# EAGLE design SoundModule (EAGLE 4.16)
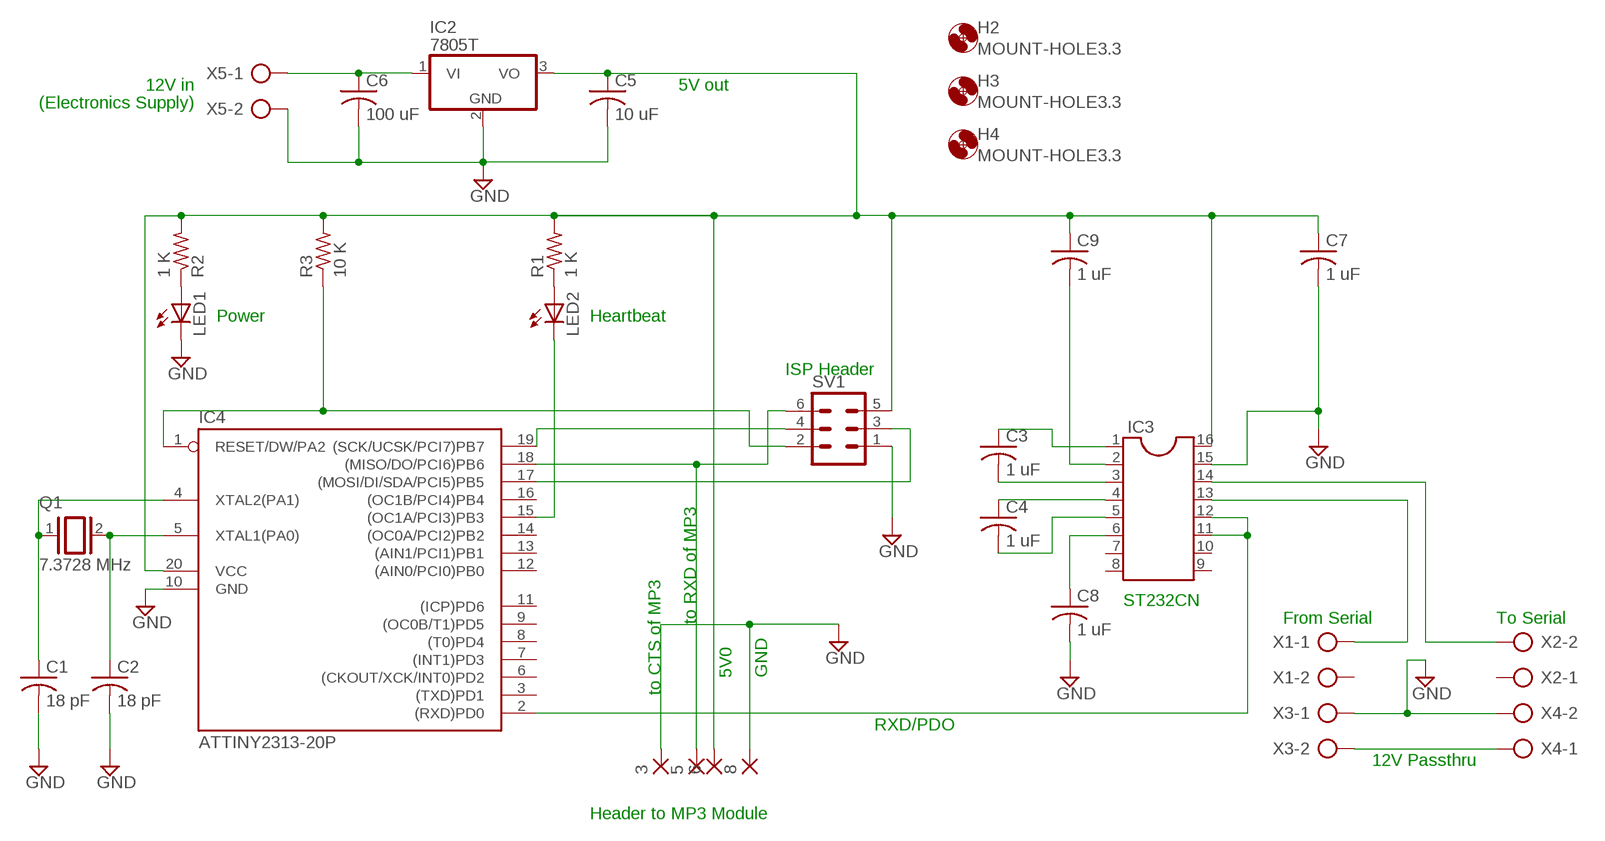
[diagram p0: schematic, sheet 1]

## Parts
3  1,6/0,8  [1,6/0,8]
5  1,6/0,8  [1,6/0,8]
6  1,6/0,8  [1,6/0,8]
8  1,6/0,8  [1,6/0,8]
C1  18 pF  C-US050-025X075  [C050-025X075]
C2  18 pF  C-US050-025X075  [C050-025X075]
C3  1 uF  C-US050-025X075  [C050-025X075]
C4  1 uF  C-US050-025X075  [C050-025X075]
C5  10 uF  C-US025-025X050  [C025-025X050]
C6  100 uF  C-US025-025X050  [C025-025X050]
C7  1 uF  C-US050-025X075  [C050-025X075]
C8  1 uF  C-US050-025X075  [C050-025X075]
C9  1 uF  C-US050-025X075  [C050-025X075]
H2  MOUNT-HOLE3.3  [3,3]
H3  MOUNT-HOLE3.3  [3,3]
H4  MOUNT-HOLE3.3  [3,3]
IC2  7805T  [TO220H]
IC3  DIL16  [DIL16]
IC4  ATTINY2313-20P  [DIL20]
LED1  LED5MM  [LED5MM]
LED2  LED5MM  [LED5MM]
Q1  7.3728 MHz  XTAL/S  [QS]
R1  1 K  R-US_0207/10  [0207/10]
R2  1 K  R-US_0207/10  [0207/10]
R3  10 K  R-US_0207/10  [0207/10]
SV1  MA03-2  [MA03-2]
X1  AK300/2  [AK300/2]
X2  AK300/2  [AK300/2]
X3  AK300/2  [AK300/2]
X4  AK300/2  [AK300/2]
X5  AK300/2  [AK300/2]

## Nets
GND: 3.1(P) 8.1(P) C1.2 C2.2 C5.2 C6.2 C7.2 C8.2 IC2.2(GND) IC3.15 IC4.10(GND) LED1.K(C) SV1.1 X3.1 X4.2 X5.2
N$1: C1.1 IC4.4(XTAL2(PA1)) Q1.1
N$2: C2.1 IC4.5(XTAL1(PA0)) Q1.2
N$3: C6.1 IC2.1(VI) X5.1
N$5: C3.1 IC3.1
N$6: 5.1(P) IC4.18((MISO/DO/PCI6)PB6) SV1.6
N$7: LED1.A R2.1
N$8: IC3.13 X1.1
N$9: IC3.14 X2.2
N$10: LED2.A R1.1
N$11: X3.2 X4.1
N$12: C3.2 IC3.3
N$13: C4.1 IC3.4
N$14: C4.2 IC3.5
N$15: C8.1 IC3.6
N$16: C9.2 IC3.2
N$18: IC4.19((SCK/UCSK/PCI7)PB7) SV1.4
N$19: IC4.17((MOSI/DI/SDA/PCI5)PB5) SV1.3
N$20: IC4.15((OC1A/PCI3)PB3) LED2.K(C)
N$22: IC4.1(RESET/DW/PA2) R3.1 SV1.2
N$23: IC3.11 IC3.12 IC4.2((RXD)PD0)
N$24: 6.1(P) C5.1 C7.1 C9.1 IC2.3(VO) IC3.16 IC4.20(VCC) R1.2 R2.2 R3.2 SV1.5
Unconnected: IC3.7 IC3.8 IC3.9 IC3.10 IC4.3((TXD)PD1) IC4.6((CKOUT/XCK/INT0)PD2) IC4.7((INT1)PD3) IC4.8((T0)PD4) IC4.9((OC0B/T1)PD5) IC4.11((ICP)PD6) IC4.12((AIN0/PCI0)PB0) IC4.13((AIN1/PCI1)PB1) IC4.14((OC0A/PCI2)PB2) IC4.16((OC1B/PCI4)PB4) X1.2 X2.1

## Notes on the sheet
- 12V in | 5V out
- (Electronics Supply)
- Power | Heartbeat
- ISP Header
- ST232CN
- to RXD of MP3 | From Serial | To Serial
- 5V0 | GND
- to CTS of MP3
- RXD/PDO
- 12V Passthru
- Header to MP3 Module

## Library data of the parts
3 5 6 8 = wirepad:1,6/0,8: THROUGH-HOLE PAD
C1-C9 = rcl:C-US: CAPACITOR, American symbol
H2-H4 = holes:MOUNT-HOLE: MOUNTING HOLE with drill center marker
IC2 = linear:78*: Positive VOLTAGE REGULATOR Source: http://cache.national.com/ds/LM/LM78L05.pdf http://www.fairchildsemi.com/ds/LM/LM7805.pdf
IC3 = ic-package:DIL16: Dual In Line
IC4 = avr:ATTINY2313: MICROCONTROLLER 2 Kbytes FLASH 128 bytes SRAM 128 bytes EEPROM USART USI
LED1 LED2 = led:LED: LED OSRAM: - CHIPLED LG R971, LG N971, LY N971, LG Q971, LY Q971, LO R971, LY R971 LH N974, LH R974 LS Q976, LO Q976, LY Q976 LO Q996 - Hyper CHIPLED LW Q18S LB Q993, LB Q99A, LB R99A - SideLED LS A670, LO A670, LY A670, LG A670, LP A670 LB A673, LV A673, LT A673, LW A673 LH A674 LY A675 LS A676, LA A676, LO A676, LY A676, LW A676 LS A679, LY A679, LG A679 - Hyper Micro SIDELED® LS Y876, LA Y876, LO Y876, LY Y876 LT Y87S - SmartLED LW L88C, LW L88S LB L89C, LB L89S, LG L890 LS L89K, LO L89K, LY L89K LS L896, LA L896, LO L896, LY L896 - TOPLED LS T670, LO T670, LY T670, LG T670, LP T670 LSG T670, LSP T670, LSY T670, LOP T670, LYG T670 LG T671, LOG T671, LSG T671 LB T673, LV T673, LT T673, LW T673 LH T674 LS T676, LA T676, LO T676, LY T676, LB T676, LH T676, LSB T676, LW T676 LB T67C, LV T67C, LT T67C, LS T67K, LO T67K, LY T67K, LW E67C LS E67B, LA E67B, LO E67B, LY E67B, LB E67C, LV E67C, LT E67C LW T67C LS T679, LY T679, LG T679 LS T770, LO T770, LY T770, LG T770, LP T770 LB T773, LV T773, LT T773, LW T773 LH T774 LS E675, LA E675, LY E675, LS T675 LS T776, LA T776, LO T776, LY T776, LB T776 LHGB T686 LT T68C, LB T68C - Hyper Mini TOPLED® LB M676 - Mini TOPLED Santana® LG M470 LS M47K, LO M47K, LY M47K Source: http://www.osram.convergy.de - LUMILED® LXK2-PW12-R00, LXK2-PW12-S00, LXK2-PW14-U00, LXK2-PW14-V00 LXK2-PM12-R00, LXK2-PM12-S00, LXK2-PM14-U00 LXK2-PE12-Q00, LXK2-PE12-R00, LXK2-PE12-S00, LXK2-PE14-T00, LXK2-PE14-U00 LXK2-PB12-K00, LXK2-PB12-L00, LXK2-PB12-M00, LXK2-PB14-N00, LXK2-PB14-P00, LXK2-PB14-Q00 LXK2-PR12-L00, LXK2-PR12-M00, LXK2-PR14-Q00, LXK2-PR14-R00 LXK2-PD12-Q00, LXK2-PD12-R00, LXK2-PD12-S00 LXK2-PH12-R00, LXK2-PH12-S00 LXK2-PL12-P00, LXK2-PL12-Q00, LXK2-PL12-R00 Source: www.luxeon.com
Q1 = special:XTAL/S: CRYSTAL
R1-R3 = rcl:R-US_: RESISTOR, American symbol
SV1 = con-lstb:MA03-2: PIN HEADER
X1-X5 = con-ptr500:AK300/2: CONNECTOR

## Board
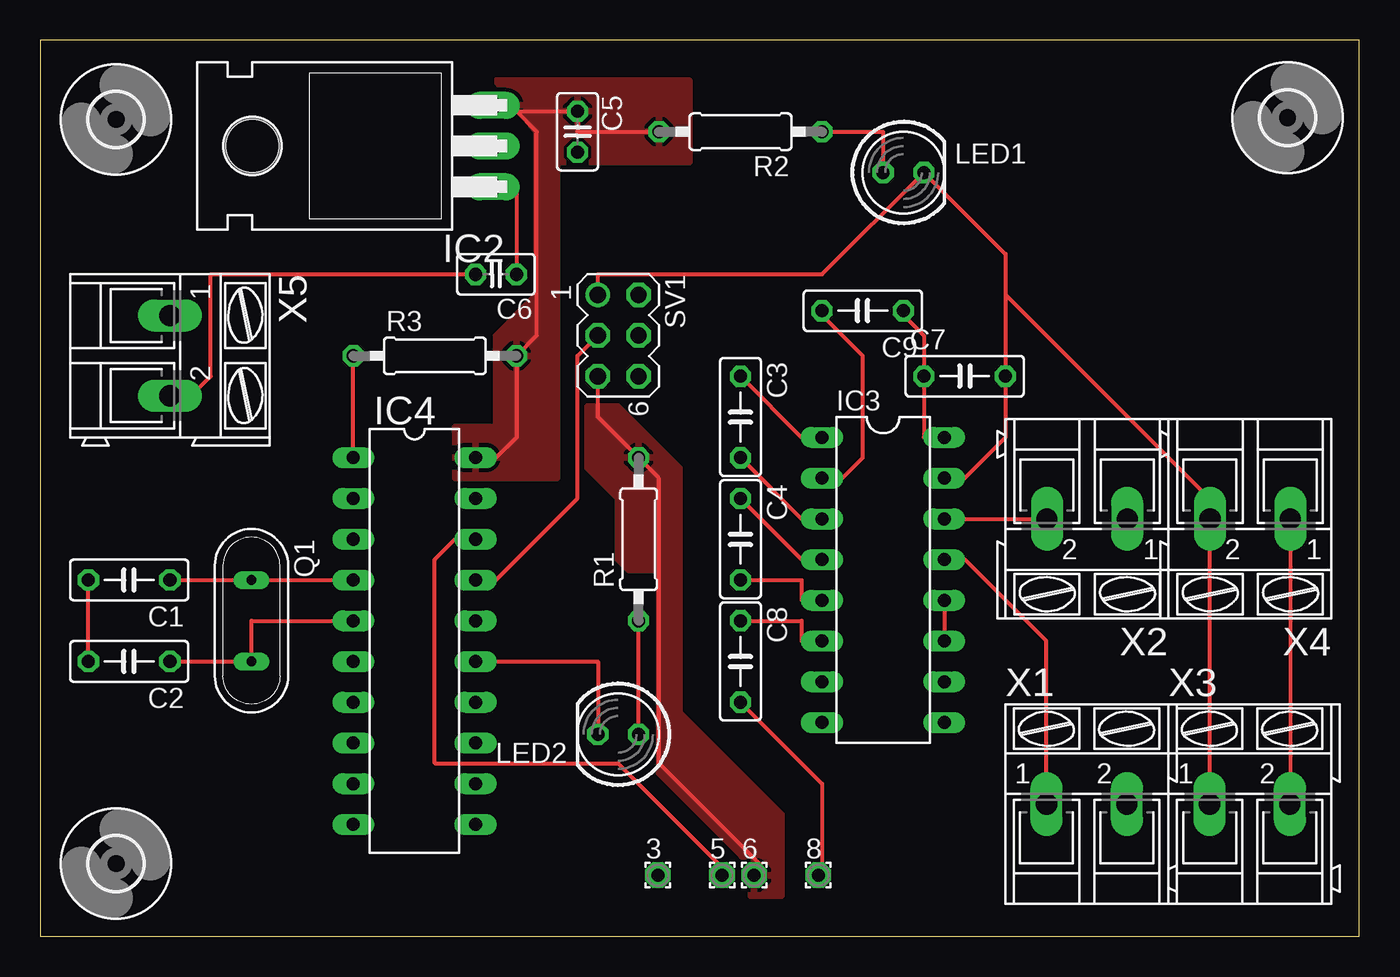
[diagram p1: board, top side]
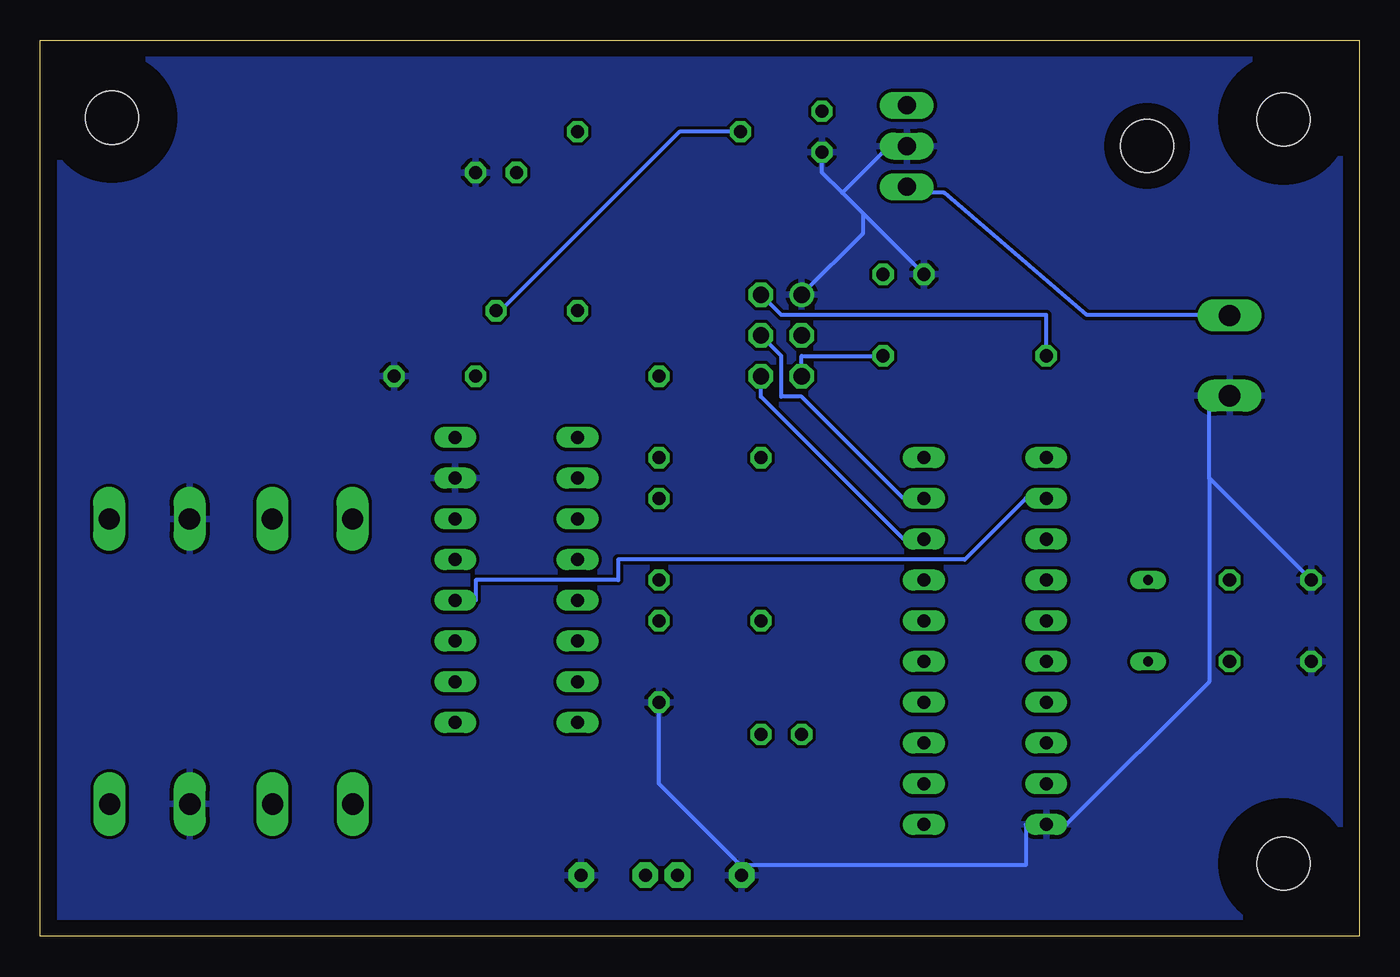
[diagram p2: board, bottom side, seen from below]

Size 82.22 x 55.87 mm. Coordinates in mm from the lower left corner, seen from the top.
Outline: 0,0 82.22,0 82.22,55.87 0,55.87 0,0
Copper layers (1*16): Top 0.035mm / dielectric 1.5mm / Bottom 0.035mm
Design rules "default": minimum track width 10mil, minimum drill 24mil, track to track 8mil, track to pad 8mil, pad to pad 8mil, via to via 8mil, smd to smd 8mil, copper to edge 40mil, drill to drill 8mil, minimum pad ring 10mil, minimum via ring 8mil, stop-mask expansion 4mil, vias tented up to drill 0mil, thermal gap 10mil

### Footprints (pad centres in the part's own frame; a part is rotated, then mirrored left to right if it is on the bottom)
1,6/0,8 = drill 0.813 pad 1.6 octagon: 1 0,0
C050-025X075 = drill 0.813 octagon: 1 -2.54,0; 2 2.54,0
C025-025X050 = drill 0.813 octagon: 1 -1.27,0; 2 1.27,0
3,3 = hole 3.3: 0,0
TO220H = drill 1.118 long: 1 -2.54,-10.16; 2 0,-10.16; 3 2.54,-10.16 | hole 3.302: 0,4.826
DIL16 = drill 0.813 long: 1 -8.89,-3.81; 2 -6.35,-3.81; 3 -3.81,-3.81; 4 -1.27,-3.81; 5 1.27,-3.81; 6 3.81,-3.81; 7 6.35,-3.81; 8 8.89,-3.81; 9 8.89,3.81; 10 6.35,3.81; 11 3.81,3.81; 12 1.27,3.81; 13 -1.27,3.81; 14 -3.81,3.81; 15 -6.35,3.81; 16 -8.89,3.81
DIL20 = drill 0.813 long: 1 -11.43,-3.81; 2 -8.89,-3.81; 3 -6.35,-3.81; 4 -3.81,-3.81; 5 -1.27,-3.81; 6 1.27,-3.81; 7 3.81,-3.81; 8 6.35,-3.81; 9 8.89,-3.81; 10 11.43,-3.81; 11 11.43,3.81; 12 8.89,3.81; 13 6.35,3.81; 14 3.81,3.81; 15 1.27,3.81; 16 -1.27,3.81; 17 -3.81,3.81; 18 -6.35,3.81; 19 -8.89,3.81; 20 -11.43,3.81
LED5MM = drill 0.813 octagon: A -1.27,0; K 1.27,0
QS = drill 0.61 long: 1 -2.54,0; 2 2.54,0
0207/10 = drill 0.813 octagon: 1 -5.08,0; 2 5.08,0
MA03-2 = drill 1.016 round: 1 -2.54,-1.27 | drill 1.016 octagon: 2 -2.54,1.27; 3 0,-1.27; 4 0,1.27; 5 2.54,-1.27; 6 2.54,1.27
AK300/2 = drill 1.321 long: 1 -2.515,0; 2 2.489,0

### Placement (x,y rotation side)
3  38.5,3.82 0 top
5  42.5,3.82 0 top
6  44.5,3.82 0 top
8  48.5,3.82 0 top
C1  5.55,22.22 180 top
C2  5.55,17.14 180 top
C3  43.65,32.38 270 top
C4  43.65,24.76 270 top
C5  33.49,50.16 270 top
C6  28.41,41.27 180 top
C7  57.62,34.92 0 top
C8  43.65,17.14 270 top
C9  51.27,39 180 top
H2  4.74,4.54 0 top
H3  4.74,50.92 0 top
H4  77.74,51.03 0 top
IC2  18.05,49.27 90 top
IC3  52.54,22.22 270 top
IC4  23.33,18.41 270 top
LED1  53.81,47.62 0 top
LED2  36.03,12.6 180 top
Q1  13.17,19.68 270 top
R1  37.3,24.76 90 top
R2  43.65,50.16 180 top
R3  24.6,36.19 0 top
SV1  36.03,37.46 270 top
X1  65.24,8.25 0 top
X2  65.24,26.03 180 top
X3  75.4,8.25 0 top
X4  75.4,26.03 180 top
X5  8.09,36.19 270 top

### Tracks (layer width: path | path; a pad name or v marks a point on that pad's centre or on a via)
GND
  Top 0.254: X3.1 72.86,9.52 72.86,24.76 X4.2 72.86,27.3 60.16,40 | IC3.15 57.62,28.57 60.16,31.11 C7.2 60.16,40 | 60.16,40 60.16,42.54 LED1.K 48.73,41.27 34.76,41.27 SV1.1 | C8.2 48.73,9.52 48.73,4.44 8.1 | C2.2 C1.2 | C6.2 10.63,41.27 10.63,34.92 9.36,33.65 X5.2
  Bottom 0.254: 38.57,4.44 43.65,9.52 C8.2 | 32.22,46.35 33.49,47.62 C5.2 | 30.95,45.08 32.22,46.35 | C6.2 30.95,45.08 | SV1.1 30.95,43.81 30.95,45.08 | 32.22,46.35 29.68,48.89 IC2.2 | 9.36,28.57 9.36,33.65 X5.2 | 9.36,28.57 9.36,15.87 18.25,6.98 IC4.10 20.79,6.98 20.79,4.44 38.57,4.44 | C1.2 9.36,28.57 | 38.57,4.44 3.1
  pour Bottom: 0.47,55.24 81.11,55.24 81.11,0.63 0.47,0.63
N$1
  Top 0.254: C1.1 Q1.1 IC4.4
N$2
  Top 0.254: C2.1 Q1.2 13.17,19.68 IC4.5
N$3
  Top 0.254: C6.1 29.68,46.35 IC2.1
  Bottom 0.254: X5.1 9.36,38.73 16.98,38.73 25.87,46.35 27.14,46.35 IC2.1
N$5
  Top 0.254: C3.1 47.46,31.11 IC3.1
N$6
  Top 0.254: 5.1 42.38,4.44 36.03,10.79 24.6,10.79 24.6,23.49 25.87,24.76 IC4.18
  Bottom 0.254: SV1.6 37.3,33.65 28.41,24.76 IC4.18
N$7
  Top 0.254: R2.1 52.54,50.16 LED1.A
N$8
  Top 0.254: IC3.13 57.62,23.49 62.7,18.41 62.7,9.52 X1.1
N$9
  Top 0.254: IC3.14 X2.2
N$10
  Top 0.254: R1.1 LED2.A 37.3,12.06
N$11
  Top 0.254: X3.2 77.94,9.52 77.94,24.76 X4.1
N$12
  Top 0.254: C3.2 47.46,26.03 IC3.3
N$13
  Top 0.254: C4.1 47.46,23.49 IC3.4
N$14
  Top 0.254: C4.2 47.46,22.22 47.46,20.95 IC3.5
N$15
  Top 0.254: C8.1 47.46,19.68 47.46,18.41 IC3.6
N$16
  Top 0.254: IC3.2 50,28.57 51.27,29.84 51.27,36.19 48.73,38.73 C9.2
N$18
  Bottom 0.254: SV1.4 36.03,36.19 36.03,33.65 34.76,33.65 28.41,27.3 IC4.19
N$19
  Top 0.254: SV1.3 33.49,36.19 33.49,27.3 28.41,22.22 IC4.17
N$20
  Top 0.254: IC4.15 34.76,17.14 LED2.K 34.76,12.06
N$22
  Top 0.254: IC4.1 R3.1
  Bottom 0.254: SV1.2 36.03,38.73 19.52,38.73 R3.1
N$23
  Top 0.254: IC3.12 IC3.11
  Bottom 0.254: IC4.2 20.79,27.3 24.6,23.49 46.19,23.49 46.19,22.22 55.08,22.22 55.08,20.95 IC3.12
N$24
  Top 0.254: IC3.16 55.08,31.11 C7.1 55.08,37.46 53.81,38.73 C9.1 | 29.68,51.43 C5.1 33.49,50.16 R2.2 | IC4.20 28.41,29.84 29.68,31.11 R3.2 30.95,37.46 30.95,50.16 29.68,51.43 | SV1.5 34.76,32.38 R1.2 38.57,28.57 38.57,10.79 44.92,4.44 6.1 | 29.68,51.43 IC2.3
  Bottom 0.254: R2.2 42.38,50.16 53.81,38.73 C9.1 | R3.2 34.76,36.19 SV1.5
  pour Top: 28.41,53.33 40.48,53.33 40.48,48.25 32.22,48.25 32.22,46.98 32.22,28.57 25.87,28.57 25.87,31.75 28.41,31.75 28.41,32.38 28.41,37.46 30.95,40 30.95,50.16
  pour Top: 34.12,33.02 35.4,33.02 36.03,33.02 39.84,29.21 39.84,13.96 41.74,12.06 45.55,8.25 46.19,7.61 46.19,2.54 44.28,2.54 44.28,4.44 43.02,5.71 38.57,10.16 38.57,22.86 36.66,22.86 36.03,23.49 36.03,27.3 34.12,29.21